# Altium schematic sheet ClockGen.SchDoc
size 431 x 279 mm; Organization: ORGANIZATION; Address1: 207; Address2: 13399 104 Ave; Address3: Surrey BC, V3T 0C9; Address4: Canada; Revision: V0.0.0; SheetNumber: 5; SheetTotal: 5; ENG_APP_DATE: --/--/--; DSN_APP_DATE: --/--/--; CHK_APP_DATE: --/--/--
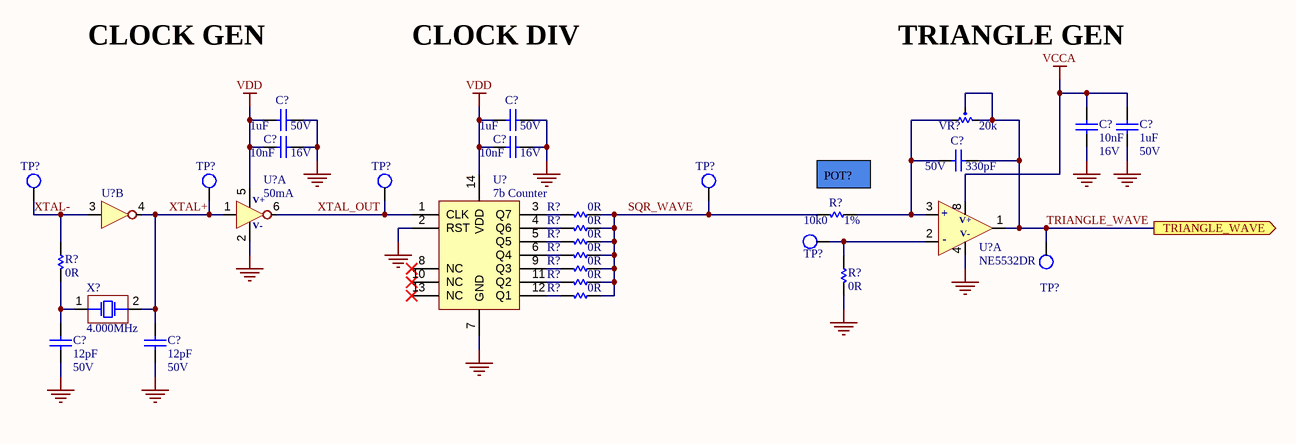
[diagram p0: ClockGen.SchDoc]

## Parts
(Parts that share a designator on the sheet are numbered #1, #2 ... from top to bottom, then left to right.)
C?#1  1uF  Voltage Rating: 50V
C?#2  1uF  Voltage Rating: 50V
C?#3  10nF  Voltage Rating: 16V  [c0402]
C?#4  1uF  Voltage Rating: 50V
C?#5  10nF  Voltage Rating: 16V  [c0402]
C?#6  10nF  Voltage Rating: 16V  [c0402]
C?#7  330pF  Voltage Rating: 50V  [c0402]
C?#8  12pF  Voltage: 50V  [C0402]
C?#9  12pF  Voltage: 50V  [C0402]
R?#1  0R  [R0402]
R?#2  10k0  Tolerance: 1%  [r0402]
R?#3  0R  [R0402]
R?#4  0R  [R0402]
R?#5  0R  [R0402]
R?#6  0R  [R0402]
R?#7  0R  [R0402]
R?#8  0R  [R0402]
R?#9  0R  [R0402]
R?#10  0R  [R0402]
TP?#1  1mm  [TESTPOINT_SMT]  (value not drawn)
TP?#2  1mm  [TESTPOINT_SMT]  (value not drawn)
TP?#3  1mm  [TESTPOINT_SMT]  (value not drawn)
TP?#4  1mm  [TESTPOINT_SMT]  (value not drawn)
TP?#5  1mm  [TESTPOINT_SMT]  (value not drawn)
TP?#6  1mm  [TESTPOINT_SMT]  (value not drawn)
U?#1  50mA  [SOT-23 6 2.9x2.8mm TI DBV0006A]  (value not drawn)  (part B of 2)
U?#2  50mA  [SOT-23 6 2.9x2.8mm TI DBV0006A]  (part A of 2)
U?#3  7b Counter  [SOIC14 8.65x3.9]
U?#4  NE5532DR  [SO8 6.2x5mm TI D0008A]  (part A of 2)
VR?  20k  [RV TC33X-2]
X?  4.000MHz  [XTAL 2pin]

## Ports
TRIANGLE_WAVE (out)

## Nets
GND: C?#1.1 C?#2.1 C?#3.1 C?#4.1 C?#5.1 C?#6.1 C?#8.1 C?#9.1 R?#8.2 U?#2.2(GND) U?#3.2(RST) U?#3.7(GND) U?#4.4(V-)
VCCA: C?#3.2 C?#4.2 U?#4.8(V+)
VDD: C?#1.2 C?#2.2 C?#5.2 C?#6.2 U?#2.5(PWR) U?#3.14(VDD)
SQR_WAVE: R?#1.1 R?#2.2 R?#3.1 R?#4.1 R?#6.1 R?#7.1 R?#9.1 R?#10.1 TP?#4.1
TRIANGLE_WAVE: C?#7.1 TP?#6.1 U?#4.1 VR?.3 ; port TRIANGLE_WAVE
XTAL+: C?#9.2 TP?#2.1 U?#1.4 U?#2.1 X?.2
XTAL-: R?#5.1 TP?#1.1 U?#1.3
XTAL_OUT: TP?#3.1 U?#2.6 U?#3.1(CLK)
NetC?#7_2: C?#7.2 R?#2.1 U?#4.3(+) VR?.1
NetC?#8_2: C?#8.2 R?#5.2 X?.1
NetR?#1_2: R?#1.2 U?#3.3(Q7)
NetR?#3_2: R?#3.2 U?#3.4(Q6)
NetR?#4_2: R?#4.2 U?#3.5(Q5)
NetR?#6_2: R?#6.2 U?#3.6(Q4)
NetR?#7_2: R?#7.2 U?#3.9(Q3)
NetR?#8_1: R?#8.1 TP?#5.1 U?#4.2(-)
NetR?#9_2: R?#9.2 U?#3.11(Q2)
NetR?#10_2: R?#10.2 U?#3.12(Q1)

Not connected (* = marked no-connect by the designer): U?#3 8(NC)* 10(NC)* 13(NC)*

## Notes on the sheet
- CLOCK GEN
- CLOCK DIV
- TRIANGLE GEN
- (near R?#2) POT?
- REV:
- PROJECT:
- DATE:
- TITLE
- SHEET
- OF
- DESIGNED:
- REVIEWED:
- (in symbol IC LOGIC INVERTER 2x 50mA, part A) V+; V-

## Library data of the parts
C?#1 C?#2 C?#4 = CAP CER 1uF 50V X5R 0603: Multilayer Ceramic Capacitors (High dielectric type), 50V, 1 uF, ± 10 %, 0603, X5R, RoHS; Manufacturer: Taiyo Yuden; Manufacturer Part Number: UMK107BJ105KA-T; Tolerance: 10%; Supplier 1: Digi-Key; RoHS: Yes; Category: Ceramic Capacitors; Stock 1: 955108; Pricing 1: 1=0.19000, 10=0.12900, 50=0.07760, 100=0.06560, 500=0.04484, 1000=0.03968 (USD); Mount: Surface Mount; Case/Package: 0603; Number of Pins: 2; Case Code (Metric): 1608; Case Code (Imperial): 0603; Contact Plating: Nickel; Min Operating Temperature: -55°C; Max Operating Temperature: 85°C; Capacitance: 1uF; Packaging: Tape and Reel; Package Quantity: 1; Dielectric: X5R; Voltage Rating (DC): 50V; Termination: SMD/SMT; Series: M; Construction: Flat; Length: 1.6mm; Width: 0.031inch; Height: 0.8mm; Depth: 0.8mm; Thickness: 0.035inch; Radiation Hardening: No; RoHS Compliant: Yes; REACH SVHC: Unknown; Halogen Free: Halogen Free; ComponentLink1URL: https://datasheet.ciiva.com/134/umk107bj105ka-t-ss-134740.pdf?src-supplier=Digi-Key; ComponentLink1Description: https://datasheet.ciiva.com/134/umk107bj105ka-t-ss-134740.pdf?src-supplier=Digi-Key; ComponentLink2URL: https://datasheet.ciiva.com/11601/umk107bj105ka-t-ss-11601811.pdf?src-supplier=Avnet; ComponentLink2Description: https://datasheet.ciiva.com/11601/umk107bj105ka-t-ss-11601811.pdf?src-supplier=Avnet; ComponentLink3URL: https://datasheet.ciiva.com/5744/1697715-5744913.pdf?src-supplier=Farnell; ComponentLink3Description: https://datasheet.ciiva.com/5744/1697715-5744913.pdf?src-supplier=Farnell; ComponentLink4URL: https://datasheet.ciiva.com/30199/43umk107bj105ka-t-30199791.pdf?src-supplier=Onlinecomponents.com; ComponentLink4Description: https://datasheet.ciiva.com/30199/43umk107bj105ka-t-30199791.pdf?src-supplier=Onlinecomponents.com; ComponentLink5URL: https://datasheet.ciiva.com/15922/336umk107bj105ka-t-15922611.pdf?src-supplier=Onlinecomponents.com; ComponentLink5Description: https://datasheet.ciiva.com/15922/336umk107bj105ka-t-15922611.pdf?src-supplier=Onlinecomponents.com; ComponentLink6URL: https://datasheet.ciiva.com/5427/mlcc-all-e-541559-5427036.pdf?src-supplier=Mouser; ComponentLink6Description: https://datasheet.ciiva.com/5427/mlcc-all-e-541559-5427036.pdf?src-supplier=Mouser; ComponentLink7URL: https://datasheet.ciiva.com/7975/mlcc-all-e-7975898.pdf?src-supplier=Element14; ComponentLink7Description: https://datasheet.ciiva.com/7975/mlcc-all-e-7975898.pdf?src-supplier=Element14; ComponentLink8URL: https://datasheet.ciiva.com/7975/1697715-7975608.pdf?src-supplier=Element14; ComponentLink8Description: https://datasheet.ciiva.com/7975/1697715-7975608.pdf?src-supplier=Element14; ComponentLink9URL: https://datasheet.ciiva.com/22694/1697715-22694278.pdf?src-supplier=Element14; ComponentLink9Description: https://datasheet.ciiva.com/22694/1697715-22694278.pdf?src-supplier=Element14; Supplier Part Number 1: 587-2400-1-ND
C?#3 C?#5 C?#6 = CAP CER 10nF 16V Y5V 0402: 0402 10 nF 16 V -20 / +80 % Tolerance Y5V SMT Multilayer Ceramic Capacitor; Manufacturer: Yageo; Manufacturer Part Number: CC0402ZRY5V7BB103; Tolerance: 80%; Insulation Resistance: 100GR; Supplier 1: Future Electronics; RoHS: Yes; Category: Ceramic Capacitors; Stock 1: 10000; Pricing 1: 10000=0.00340, 30000=0.00320, 100000=0.00300, 200000=0.00290, 400000=0.00270 (USD); Mount: Surface Mount; Case/Package: 0402; Number of Pins: 2; Case Code (Imperial): 0402; Case Code (Metric): 1005; Dielectric Material: Ceramic; Min Operating Temperature: -55°C; Max Operating Temperature: 85°C; Capacitance: 10nF; Packaging: Tape and Reel; Voltage Rating (DC): 16V; Dielectric: Y5V; Termination: SMD/SMT; Series: CC; Package Quantity: 10000; Construction: Flat; Length: 1mm; Width: 0.02inch; Height: 0.5mm; Depth: 0.5mm; Thickness: 0.022inch; Terminal Length: 0.225mm; Radiation Hardening: No; RoHS Compliant: Yes; Lead Free: Lead Free; REACH SVHC: No SVHC; Halogen Free: Halogen Free; ComponentLink1URL: https://datasheet.ciiva.com/144/mlccorderingcode-144484.pdf?src-supplier=Digi-Key; ComponentLink1Description: https://datasheet.ciiva.com/144/mlccorderingcode-144484.pdf?src-supplier=Digi-Key; ComponentLink2URL: https://datasheet.ciiva.com/144/mlccorderingcode-144485.pdf?src-supplier=Digi-Key; ComponentLink2Description: https://datasheet.ciiva.com/144/mlccorderingcode-144485.pdf?src-supplier=Digi-Key; ComponentLink3URL: https://datasheet.ciiva.com/144/mlccorderingcode-144486.pdf?src-supplier=Digi-Key; ComponentLink3Description: https://datasheet.ciiva.com/144/mlccorderingcode-144486.pdf?src-supplier=Digi-Key; ComponentLink4URL: https://datasheet.ciiva.com/11586/upy-gphc-y5v-6-3v-to-50v-5-11586517.pdf?src-supplier=Avnet; ComponentLink4Description: https://datasheet.ciiva.com/11586/upy-gphc-y5v-6-3v-to-50v-5-11586517.pdf?src-supplier=Avnet; ComponentLink5URL: https://datasheet.ciiva.com/5789/1132289-5789565.pdf?src-supplier=Farnell; ComponentLink5Description: https://datasheet.ciiva.com/5789/1132289-5789565.pdf?src-supplier=Farnell; ComponentLink6URL: https://datasheet.ciiva.com/5789/1132289-5789566.pdf?src-supplier=Farnell; ComponentLink6Description: https://datasheet.ciiva.com/5789/1132289-5789566.pdf?src-supplier=Farnell; ComponentLink7URL: https://datasheet.ciiva.com/17437/upy-gphc-y5v-6-3v-to-50v-5-17437221.pdf?src-supplier=Avnet+Europe; ComponentLink7Description: https://datasheet.ciiva.com/17437/upy-gphc-y5v-6-3v-to-50v-5-17437221.pdf?src-supplier=Avnet+Europe; ComponentLink8URL: https://datasheet.ciiva.com/8033/1132289-8033641.pdf?src-supplier=Element14; ComponentLink8Description: https://datasheet.ciiva.com/8033/1132289-8033641.pdf?src-supplier=Element14; ComponentLink9URL: https://datasheet.ciiva.com/8033/1132289-8033642.pdf?src-supplier=Element14; ComponentLink9Description: https://datasheet.ciiva.com/8033/1132289-8033642.pdf?src-supplier=Element14; Supplier Part Number 1: 1300987
C?#7 = CAP CER 330pF 50V C0G 0402: Multilayer Ceramic Capacitor, 330 pF, 5%, C0G / NP0, 50 V, 0402 [1005 Metric] RoHS Compliant: Yes; Manufacturer: Walsin Technologies; Manufacturer Part Number: 0402N331J500CT; Supplier 1: Digi-Key; RoHS: Yes; Category: Ceramic Capacitors; Stock 1: 670585; Pricing 1: 1=0.10000, 10=0.02700, 50=0.01460, 100=0.01190, 500=0.00848, 1000=0.00666, 2500=0.00605, 5000=0.00557 (USD); Case/Package: 0402; Case Code (Metric): 1005; Case Code (Imperial): 0402; Min Operating Temperature: -55°C; Max Operating Temperature: 125°C; Tolerance: 5%; Packaging: Tape and Reel; Capacitance: 330pF; Dielectric: C0G; Voltage Rating (DC): 50V; Length: 1mm; Depth: 0.5mm; REACH SVHC: Unknown; RoHS Compliant: Yes; ComponentLink1URL: http://www.farnell.com/datasheets/1958513.pdf?src-supplier=Farnell; ComponentLink1Description: http://www.farnell.com/datasheets/1958513.pdf?src-supplier=Farnell; ComponentLink2URL: http://www.farnell.com/datasheets/2340522.pdf?src-supplier=Farnell; ComponentLink2Description: http://www.farnell.com/datasheets/2340522.pdf?src-supplier=Farnell; ComponentLink3URL: http://components.arrow.com/part/dataview/0323_03460079?src-supplier=Arrow+Europe; ComponentLink3Description: http://components.arrow.com/part/dataview/0323_03460079?src-supplier=Arrow+Europe; ComponentLink4URL: http://www.farnell.com/datasheets/1958513.pdf?src-supplier=Element14; ComponentLink4Description: http://www.farnell.com/datasheets/1958513.pdf?src-supplier=Element14; ComponentLink5URL: http://www.passivecomponent.com/wp-content/uploads/2018/10/MLCC.pdf?src-supplier=Digi-Key; ComponentLink5Description: http://www.passivecomponent.com/wp-content/uploads/2018/10/MLCC.pdf?src-supplier=Digi-Key; Supplier Part Number 1: 1292-1308-1-ND
C?#8 C?#9 = CAP CER 12pF 50V C0G 0402: Ceramic capacitor SMD-0402 12pF /50V C0G# J +-5%, Samsung, RoHS; Manufacturer Part Number: CL05C120JB5NNNC; Tolerance: 5%; Dielectric: C0G; Temperature Coefficient: 300ppm/°C; Supplier 1: Digi-Key; Manufacturer: Samsung; RoHS: Yes; Category: Ceramic Capacitors; Stock 1: 41998; Pricing 1: 10000=0.00386, 20000=0.00367 (USD); Mount: Surface Mount; Case/Package: 0402; Case Code (Metric): 1005; Case Code (Imperial): 0402; Material: Ceramic; Contact Plating: Tin; Min Operating Temperature: -55°C; Max Operating Temperature: 125°C; Capacitance: 12pF; Package Quantity: 1; Packaging: Tape and Reel; Voltage Rating: 50V; Series: CL; Construction: Flat; Voltage Rating (DC): 50V; Length: 1mm; Width: 0.02inch; Height: 0.5mm; Thickness: 0.022inch; Depth: 0.5mm; Radiation Hardening: No; RoHS Compliant: Yes; Lead Free: Lead Free; ComponentLink1URL: https://datasheet.ciiva.com/25806/cl05c120jb5nnnc-25806484.pdf?src-supplier=Digi-Key; ComponentLink1Description: https://datasheet.ciiva.com/25806/cl05c120jb5nnnc-25806484.pdf?src-supplier=Digi-Key; ComponentLink2URL: https://datasheet.ciiva.com/26838/getdatasheetpartid-658047-26838280.pdf?src-supplier=Verical; ComponentLink2Description: https://datasheet.ciiva.com/26838/getdatasheetpartid-658047-26838280.pdf?src-supplier=Verical; ComponentLink3URL: https://datasheet.ciiva.com/29198/458703-da-01-en-vs-kondensator-0402-29198421.pdf?src-supplier=Conrad; ComponentLink3Description: https://datasheet.ciiva.com/29198/458703-da-01-en-vs-kondensator-0402-29198421.pdf?src-supplier=Conrad; ComponentLink4URL: https://datasheet.ciiva.com/16449/cl05b104kq5nnnc-16449055.pdf?src-supplier=Future+Electronics; ComponentLink4Description: https://datasheet.ciiva.com/16449/cl05b104kq5nnnc-16449055.pdf?src-supplier=Future+Electronics; Supplier Part Number 1: 1276-1178-2-ND
R?#1 R?#3-R?#10 = RES 0R 63mW 0402: GLOVE, POLYAMIDE, L/FREE, PU, SIZE 6 - More Details; Manufacturer: Stackpole Electronics; Manufacturer Part Number: RMCF0402ZT0R00; Power Rating: 63mW; Current Rating: 1A; Working Voltage: 50V; Supplier 1: Digi-Key; RoHS: Yes; Category: Chip SMD Resistors; Stock 1: 5203223; Pricing 1: 1=0.10000, 10=0.01000, 25=0.00720, 50=0.00560, 100=0.00410, 250=0.00316, 500=0.00252, 1000=0.00186, 5000=0.00133 (USD); Mount: Surface Mount; Case/Package: 0402; Case Code (Metric): 1005; Case Code (Imperial): 0402; Contact Plating: Tin,Matte; Min Operating Temperature: -55°C; Max Operating Temperature: 155°C; Resistance: 0R; Packaging: Tape and Reel; Resistor Type: Thick Film; Number of Terminations: 2; Max Power Dissipation: 63mW; Features: Automotive AEC-Q200; Series: RMCF; Technology: THICK FILM; Construction: Rectangular; Length: 0.039inch; Width: 0.02inch; Height: 0.016inch; Depth: 0.5mm; Radiation Hardening: No; Military Standard: Not; Lead Free: Lead Free; RoHS Compliant: Yes; ComponentLink1URL: https://datasheet.ciiva.com/26835/getdatasheetpartid-409751-26835612.pdf?src-supplier=Verical; ComponentLink1Description: https://datasheet.ciiva.com/26835/getdatasheetpartid-409751-26835612.pdf?src-supplier=Verical; Supplier Part Number 1: RMCF0402ZT0R00CT-ND
R?#2 = RES 10k0 1% 63mW 0402: Res General Purpose Thick Film 0402 10K Ohm 1% 1/16W ±100ppm/°C Molded SMD Paper T/R; Manufacturer: Yageo; Manufacturer Part Number: RC0402FR-0710KL; Resistance: 10kR; Voltage Rating (DC): 50V; Power Rating: 62.5mW; Max Power Dissipation: 63mW; Supplier 1: RSComponents; RoHS: Yes; Category: Chip SMD Resistors; Stock 1: 29900; Pricing 1: 10000=0.00300 (GBP); Case/Package: 0402; Number of Pins: 2; Case Code (Imperial): 0402; Case Code (Metric): 1005; Min Operating Temperature: -55°C; Max Operating Temperature: 155°C; Resistor Type: Thick Film; Temperature Coefficient: 100ppm/°C; Packaging: Tape and Reel; Voltage Rating: 50V; Termination: SMD/SMT; Working Voltage: 50V; Number of Terminations: 2; Features: Moisture Resistant; Series: RC; Resistance Tolerance: 1%; Construction: Rectangular; Length: 1mm; Width: 0.5mm; Height: 0.32mm; Depth: 0.5mm; Lead Pitch: 0.2mm; REACH SVHC: No SVHC; Lead Free: Lead Free; RoHS Compliant: Yes; Military Standard: Not; ComponentLink1URL: https://datasheet.ciiva.com/7660/38568-7660787.pdf?src-supplier=Element14; ComponentLink1Description: https://datasheet.ciiva.com/7660/38568-7660787.pdf?src-supplier=Element14; ComponentLink2URL: https://datasheet.ciiva.com/12667/pyu-rc0402-51-rohs-l-6-r-12667067.pdf?src-supplier=Mouser; ComponentLink2Description: https://datasheet.ciiva.com/12667/pyu-rc0402-51-rohs-l-6-r-12667067.pdf?src-supplier=Mouser; ComponentLink3URL: https://datasheet.ciiva.com/7849/1784430-7849813.pdf?src-supplier=Element14; ComponentLink3Description: https://datasheet.ciiva.com/7849/1784430-7849813.pdf?src-supplier=Element14; ComponentLink4URL: https://datasheet.ciiva.com/7849/1686128-7849814.pdf?src-supplier=Element14; ComponentLink4Description: https://datasheet.ciiva.com/7849/1686128-7849814.pdf?src-supplier=Element14; ComponentLink5URL: https://datasheet.ciiva.com/7849/1784430-7849815.pdf?src-supplier=Element14; ComponentLink5Description: https://datasheet.ciiva.com/7849/1784430-7849815.pdf?src-supplier=Element14; ComponentLink6URL: https://datasheet.ciiva.com/7983/1018594-7983486.pdf?src-supplier=Element14; ComponentLink6Description: https://datasheet.ciiva.com/7983/1018594-7983486.pdf?src-supplier=Element14; ComponentLink7URL: https://datasheet.ciiva.com/22747/1018594-22747512.pdf?src-supplier=Element14; ComponentLink7Description: https://datasheet.ciiva.com/22747/1018594-22747512.pdf?src-supplier=Element14; Supplier Part Number 1: 1987643
TP?#1-TP?#6 = TP 1mm: SMT testpoint
U?#1 U?#2 = IC LOGIC INVERTER 2x 50mA: Buffer 2-CH Non-Inverting Push-Pull CMOS 6-Pin SOT-23 T/R; Manufacturer: Texas Instruments; Manufacturer Part Number: SN74LVC2G34DBVR; Logic Function: Buffer,Inverting; Min Supply Voltage: 1.65V; Max Supply Voltage: 5.5V; Number of Channels: 2; Propagation Delay: 3.2ns; Number of Bits per Element: 1; High Level Output Current: -32mA; Low Level Output Current: 32mA; Turn-On Delay Time: 8.6ns; Quiescent Current: 10uA; Schmitt Trigger Input: No; Nominal Supply Current: 250mA; Supplier 1: Arrow Electronics; RoHS: Yes; Category: Buffers, Drivers and Transceivers; Stock 1: 261; Pricing 1: 3000=0.09770 (USD); Mount: Surface Mount; Case/Package: SOT-23; Number of Pins: 6; Contact Plating: Tin,Matte; Min Operating Temperature: -40°C; Max Operating Temperature: 125°C; Polarity: Non-Inverting; Packaging: Tape and Reel; Number of Inputs: 2; Number of Outputs: 2; Package Quantity: 3000; Number of Elements: 2; Number of Input Lines: 2; Number of Output Lines: 2; Number of Gates: 2; Number of Bits: 2; Number of Circuits: 2; Output Current: 32mA; Max Output Current: 32mA; Termination: SMD/SMT; Length: 2.9mm; Width: 1.6mm; Height: 1.15mm; Radiation Hardening: No; Lead Free: Lead Free; RoHS Compliant: Yes; REACH SVHC: No SVHC; ComponentLink1URL: https://datasheet.ciiva.com/27051/1046431-27051311.pdf?src-supplier=Jameco; ComponentLink1Description: https://datasheet.ciiva.com/27051/1046431-27051311.pdf?src-supplier=Jameco; ComponentLink2URL: https://datasheet.ciiva.com/7744/1771621-7744033.pdf?src-supplier=Element14; ComponentLink2Description: https://datasheet.ciiva.com/7744/1771621-7744033.pdf?src-supplier=Element14; ComponentLink3URL: https://datasheet.ciiva.com/15094/getdatasheetpartid-133639-15094759.pdf?src-supplier=Verical; ComponentLink3Description: https://datasheet.ciiva.com/15094/getdatasheetpartid-133639-15094759.pdf?src-supplier=Verical; ComponentLink4URL: https://datasheet.ciiva.com/14301/sn74lvc2g34-14301216.pdf?src-supplier=Avnet; ComponentLink4Description: https://datasheet.ciiva.com/14301/sn74lvc2g34-14301216.pdf?src-supplier=Avnet; ComponentLink5URL: https://datasheet.ciiva.com/46439/1785989-46439658.pdf?src-supplier=Element14; ComponentLink5Description: https://datasheet.ciiva.com/46439/1785989-46439658.pdf?src-supplier=Element14; ComponentLink6URL: https://datasheet.ciiva.com/1834/sn74lvc2g34-1834122.pdf?src-supplier=Digi-Key; ComponentLink6Description: https://datasheet.ciiva.com/1834/sn74lvc2g34-1834122.pdf?src-supplier=Digi-Key; ComponentLink7URL: https://datasheet.ciiva.com/1834/sn74lvc2g34-1834121.pdf?src-supplier=Digi-Key; ComponentLink7Description: https://datasheet.ciiva.com/1834/sn74lvc2g34-1834121.pdf?src-supplier=Digi-Key; ComponentLink8URL: https://datasheet.ciiva.com/1834/sn74lvc2g34-1834123.pdf?src-supplier=Digi-Key; ComponentLink8Description: https://datasheet.ciiva.com/1834/sn74lvc2g34-1834123.pdf?src-supplier=Digi-Key; ComponentLink9URL: https://datasheet.ciiva.com/14301/sn74lvc2g34-14301215.pdf?src-supplier=Avnet; ComponentLink9Description: https://datasheet.ciiva.com/14301/sn74lvc2g34-14301215.pdf?src-supplier=Avnet; ComponentLink10URL: https://datasheet.ciiva.com/16532/sn74lvc2g34-16532026.pdf?src-supplier=Avnet+Asia; ComponentLink10Description: https://datasheet.ciiva.com/16532/sn74lvc2g34-16532026.pdf?src-supplier=Avnet+Asia; ComponentLink11URL: https://datasheet.ciiva.com/48703/001074027-da-01-en-ic-buffer-d-sn74lvc2g34dbvr-sot-23-6-tid-48703269.pdf?src-supplier=Conrad; ComponentLink11Description: https://datasheet.ciiva.com/48703/001074027-da-01-en-ic-buffer-d-sn74lvc2g34dbvr-sot-23-6-tid-48703269.pdf?src-supplier=Conrad; Supplier Part Number 1: SN74LVC2G34DBVR
U?#3 = IC LOGIC 7B COUNTER: MC14024BDG 7-stage Binary Counter; Up Counter; 3 - 18 V; 14-Pin SOIC; Manufacturer: ON Semiconductor; Direction: Up,Unidirectional; Max Supply Voltage: 18V; Min Supply Voltage: 3V; Number of Elements: 1; Propagation Delay: 2000ns; Number of Output Lines: 7; Reset: Asynchronous; Frequency: 12MHz; Output Characteristics: DIFFERENTIAL; Supplier 1: Digi-Key; Manufacturer Part Number: MC14024BDG; RoHS: Yes; Category: Counters; Stock 1: 1443; Pricing 1: 1=0.63000, 10=0.55600, 25=0.52240, 100=0.42640, 250=0.39608, 500=0.33708, 1000=0.27825 (USD); Mount: Surface Mount; Case/Package: SOIC; Number of Pins: 14; Min Operating Temperature: -55°C; Max Operating Temperature: 125°C; Packaging: Rail/Tube; Package Quantity: 55; Number of Circuits: 1; Number of Input Lines: 1; Logic Function: Counter; Number of Bits per Element: 7; Number of Bits: 7; Turn-On Delay Time: 2000ns; Series: 4000B; Technology: CMOS; Number of Functions: 1; Supply Voltage-Nom: 18V; Length: 8.75mm; Width: 4mm; Height: 1.5mm; Radiation Hardening: No; REACH SVHC: No SVHC; Lead Free: Lead Free; Halogen Free: Halogen Free; RoHS Compliant: Yes; ComponentLink1URL: https://datasheet.ciiva.com/15093/getdatasheetpartid-147916-15093453.pdf?src-supplier=Verical; ComponentLink1Description: https://datasheet.ciiva.com/15093/getdatasheetpartid-147916-15093453.pdf?src-supplier=Verical; ComponentLink2URL: https://datasheet.ciiva.com/1506/1691447-1506837.pdf?src-supplier=Element14; ComponentLink2Description: https://datasheet.ciiva.com/1506/1691447-1506837.pdf?src-supplier=Element14; ComponentLink3URL: https://datasheet.ciiva.com/1622/76285-1622497.pdf?src-supplier=Newark; ComponentLink3Description: https://datasheet.ciiva.com/1622/76285-1622497.pdf?src-supplier=Newark; ComponentLink4URL: https://datasheet.ciiva.com/16977/0900766b805fa2a2-16977232.pdf?src-supplier=Allied+Electronics; ComponentLink4Description: https://datasheet.ciiva.com/16977/0900766b805fa2a2-16977232.pdf?src-supplier=Allied+Electronics; ComponentLink5URL: https://datasheet.ciiva.com/8252/mc14024b-d-8252619.pdf?src-supplier=Avnet; ComponentLink5Description: https://datasheet.ciiva.com/8252/mc14024b-d-8252619.pdf?src-supplier=Avnet; ComponentLink6URL: https://datasheet.ciiva.com/16392/mc14024b-d-16392830.pdf?src-supplier=Future+Electronics; ComponentLink6Description: https://datasheet.ciiva.com/16392/mc14024b-d-16392830.pdf?src-supplier=Future+Electronics; ComponentLink7URL: https://datasheet.ciiva.com/26221/mc14024b-d-26221639.pdf?src-supplier=Avnet+Europe; ComponentLink7Description: https://datasheet.ciiva.com/26221/mc14024b-d-26221639.pdf?src-supplier=Avnet+Europe; Supplier Part Number 1: MC14024BDGOS-ND
U?#4 = IC OPAMP AUDIO NE5532DR: 2-channel, 10-MHz, 26-V output swing, low-noise audio op amp 8-SOIC 0 to 70; Manufacturer: Texas Instruments; Voltage Gain: 100dB; Min Dual Supply Voltage: 5V; Max Dual Supply Voltage: 15V; Output Current: 38mA; Nominal Supply Current: 16mA; Common Mode Rejection Ratio: 70dB; Number of Channels: 2; Slew Rate: 9V/µs; Gain Bandwidth Product: 10MHz; Input Bias Current: 800nA; Input Offset Voltage (Vos): 4mV; Operating Supply Current: 8mA; Dual Supply Voltage: 9V; Supplier 1: Digi-Key; Manufacturer Part Number: NE5532DR; RoHS: Yes; Category: Amplifiers - Op Amps, Buffer, Instrumentation; Stock 1: 29111; Pricing 1: 1=0.60000, 10=0.51300, 25=0.47840, 100=0.38290, 250=0.35552, 500=0.30082, 1000=0.23246 (USD); Case/Package: D; Number of Pins: 8; Contact Plating: Gold; Min Operating Temperature: 0°C; Max Operating Temperature: 70°C; Packaging: Tape and Reel; Package Quantity: 1; Number of Circuits: 2; Output Current per Channel: 38mA; Nominal Gain Bandwidth Product: 10MHz; Unity Gain Bandwidth Product: 10MHz; Number of Elements: 2; Bandwidth: 10MHz; Max I/O Voltage: 4mV; Max Supply Voltage: 15V; Number of Amplifiers: 2; Length: 4.9mm; Width: 3.91mm; Height: 1.58mm; Radiation Hardening: No; Lead Free: Lead Free; RoHS Compliant: Yes; REACH SVHC: No SVHC; ComponentLink1URL: https://datasheet.ciiva.com/1796/ne5532-1796190.pdf?src-supplier=Digi-Key; ComponentLink1Description: https://datasheet.ciiva.com/1796/ne5532-1796190.pdf?src-supplier=Digi-Key; ComponentLink2URL: https://datasheet.ciiva.com/1796/ne5532-1796189.pdf?src-supplier=Digi-Key; ComponentLink2Description: https://datasheet.ciiva.com/1796/ne5532-1796189.pdf?src-supplier=Digi-Key; ComponentLink3URL: https://datasheet.ciiva.com/1796/ne5532-1796191.pdf?src-supplier=Digi-Key; ComponentLink3Description: https://datasheet.ciiva.com/1796/ne5532-1796191.pdf?src-supplier=Digi-Key; Supplier Part Number 1: 296-13622-1-ND
VR? = TC33X-2-203E: Res Trimmer 20K Ohm 25% 1/10W 1(Elec)/1(Mech)Turn (3 X 3.8mm) Foot Print SMD Embossed T/R; Manufacturer: Bourns; Resistance: 20kR; Power Rating: 100mW; Number of Turns: 1; Temperature Coefficient: 250ppm/°C; Supplier 1: Digi-Key; Manufacturer Part Number: TC33X-2-203E; RoHS: Yes; Category: Variable Resistors and Potentiometers; Stock 1: 95244; Pricing 1: 1=0.26000, 10=0.25200, 25=0.22760, 50=0.21700, 100=0.21000, 250=0.19600, 500=0.17850, 1000=0.16100 (USD); Mount: Surface Mount; Min Operating Temperature: -40°C; Max Operating Temperature: 100°C; Tolerance: 25%; Packaging: Tape and Reel; Package Quantity: 2500; Resistor Type: Cermet; Termination: Foot Print; Max Power Dissipation: 100mW; Series: TC33; Resistance Tolerance: 25%; Length: 3mm; Width: 0.118inch; Height: 0.047inch; Depth: 3.8mm; Radiation Hardening: No; REACH SVHC: No SVHC; Military Standard: Not; RoHS Compliant: Yes; ComponentLink1URL: https://datasheet.ciiva.com/22671/1537288-22671216.pdf?src-supplier=Element14; ComponentLink1Description: https://datasheet.ciiva.com/22671/1537288-22671216.pdf?src-supplier=Element14; ComponentLink2URL: https://datasheet.ciiva.com/11833/0900766b802749b3-11833400.pdf?src-supplier=RSComponents; ComponentLink2Description: https://datasheet.ciiva.com/11833/0900766b802749b3-11833400.pdf?src-supplier=RSComponents; ComponentLink3URL: https://datasheet.ciiva.com/6227/tc33-6227117.pdf?src-supplier=Digi-Key; ComponentLink3Description: https://datasheet.ciiva.com/6227/tc33-6227117.pdf?src-supplier=Digi-Key; ComponentLink4URL: https://datasheet.ciiva.com/6227/tc33-6227118.pdf?src-supplier=Digi-Key; ComponentLink4Description: https://datasheet.ciiva.com/6227/tc33-6227118.pdf?src-supplier=Digi-Key; ComponentLink5URL: https://datasheet.ciiva.com/6227/tc33-6227119.pdf?src-supplier=Digi-Key; ComponentLink5Description: https://datasheet.ciiva.com/6227/tc33-6227119.pdf?src-supplier=Digi-Key; ComponentLink6URL: https://datasheet.ciiva.com/30078/tc33-30078556.pdf?src-supplier=Onlinecomponents.com; ComponentLink6Description: https://datasheet.ciiva.com/30078/tc33-30078556.pdf?src-supplier=Onlinecomponents.com; ComponentLink7URL: https://datasheet.ciiva.com/15156/getdatasheetpartid-128027-15156621.pdf?src-supplier=Verical; ComponentLink7Description: https://datasheet.ciiva.com/15156/getdatasheetpartid-128027-15156621.pdf?src-supplier=Verical; ComponentLink8URL: https://datasheet.ciiva.com/7953/1818686-7953350.pdf?src-supplier=Element14; ComponentLink8Description: https://datasheet.ciiva.com/7953/1818686-7953350.pdf?src-supplier=Element14; ComponentLink9URL: https://datasheet.ciiva.com/22718/1520225-22718588.pdf?src-supplier=Element14; ComponentLink9Description: https://datasheet.ciiva.com/22718/1520225-22718588.pdf?src-supplier=Element14; Supplier Part Number 1: TC33X-2-203ECT-ND
X? = XTAL 4.000MHz 18pF HC-49: Crystal 4MHz ±30ppm (Tol) ±50ppm (Stability) 18pF FUND 180Ohm 2-Pin HC-49/US SMD T/R; Manufacturer: Abracon; Manufacturer Part Number: ABLS-4.000MHZ-B4-T; ESR (Equivalent Series Resistance): 180R; Supplier 1: Digi-Key; RoHS: Yes; Category: Crystals; Stock 1: 302; Pricing 1: 1=0.32000, 10=0.26400, 50=0.23760, 100=0.21120, 500=0.20064 (USD); Mount: Surface Mount; Case/Package: SMD/SMT; Min Operating Temperature: -20°C; Max Operating Temperature: 70°C; Package Quantity: 1000; Frequency: 4MHz; Frequency Tolerance: 30ppm; Load Capacitance: 18pF; Packaging: Tape and Reel; Tolerance: 30ppm; Frequency Stability: 50ppm; Termination: SMD/SMT; Series: ABLS; Series Resistance: 180R; Operating Frequency: 4 MHz; Length: 11.4mm; Width: 0.185inch; Height: 0.165inch; Depth: 4.7mm; Radiation Hardening: No; REACH SVHC: Yes; Lead Free: Lead Free; ComponentLink1URL: https://datasheet.ciiva.com/15116/getdatasheetpartid-723826-15116860.pdf?src-supplier=Verical; ComponentLink1Description: https://datasheet.ciiva.com/15116/getdatasheetpartid-723826-15116860.pdf?src-supplier=Verical; ComponentLink2URL: https://datasheet.ciiva.com/860/abls-860304.pdf?src-supplier=Digi-Key; ComponentLink2Description: https://datasheet.ciiva.com/860/abls-860304.pdf?src-supplier=Digi-Key; ComponentLink3URL: https://datasheet.ciiva.com/860/abls-860305.pdf?src-supplier=Digi-Key; ComponentLink3Description: https://datasheet.ciiva.com/860/abls-860305.pdf?src-supplier=Digi-Key; ComponentLink4URL: https://datasheet.ciiva.com/860/abls-860306.pdf?src-supplier=Digi-Key; ComponentLink4Description: https://datasheet.ciiva.com/860/abls-860306.pdf?src-supplier=Digi-Key; ComponentLink5URL: https://datasheet.ciiva.com/3175/abls-3175417.pdf?src-supplier=Avnet; ComponentLink5Description: https://datasheet.ciiva.com/3175/abls-3175417.pdf?src-supplier=Avnet; Supplier Part Number 1: 535-10202-1-ND